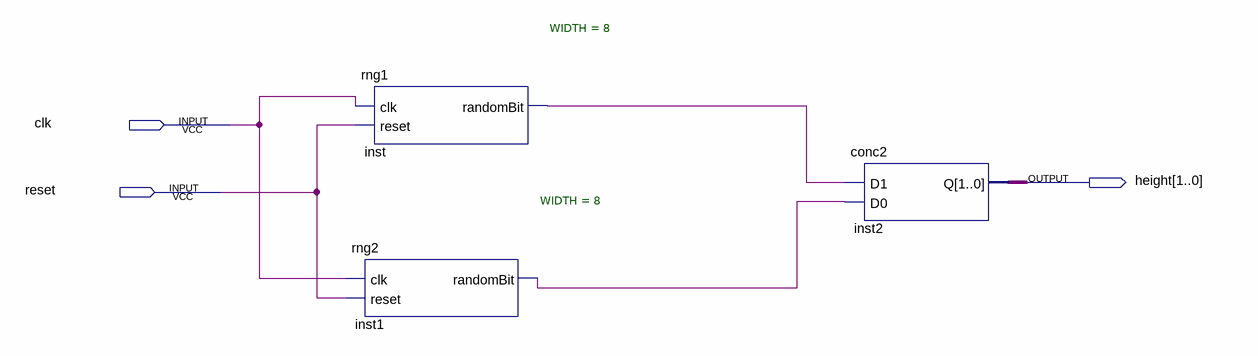
[diagram p0: schematic sheet]
// Quartus schematic height_gen.bdf as structural Verilog: 3 symbols, 3 pins
module height_gen (
  input  clk,
  input  reset,
  output [1:0] height
);

  wire inst1_randombit, inst_randombit;

  rng1 #(.WIDTH(8)) inst (.clk(clk), .reset(reset), .randomBit(inst_randombit));
  rng2 #(.WIDTH(8)) inst1 (.clk(clk), .reset(reset), .randomBit(inst1_randombit));
  conc2 inst2 (.D1(inst_randombit), .D0(inst1_randombit), .Q(height));
endmodule
